# EAGLE design pycopter_board_v1 (EAGLE 7.7.0)
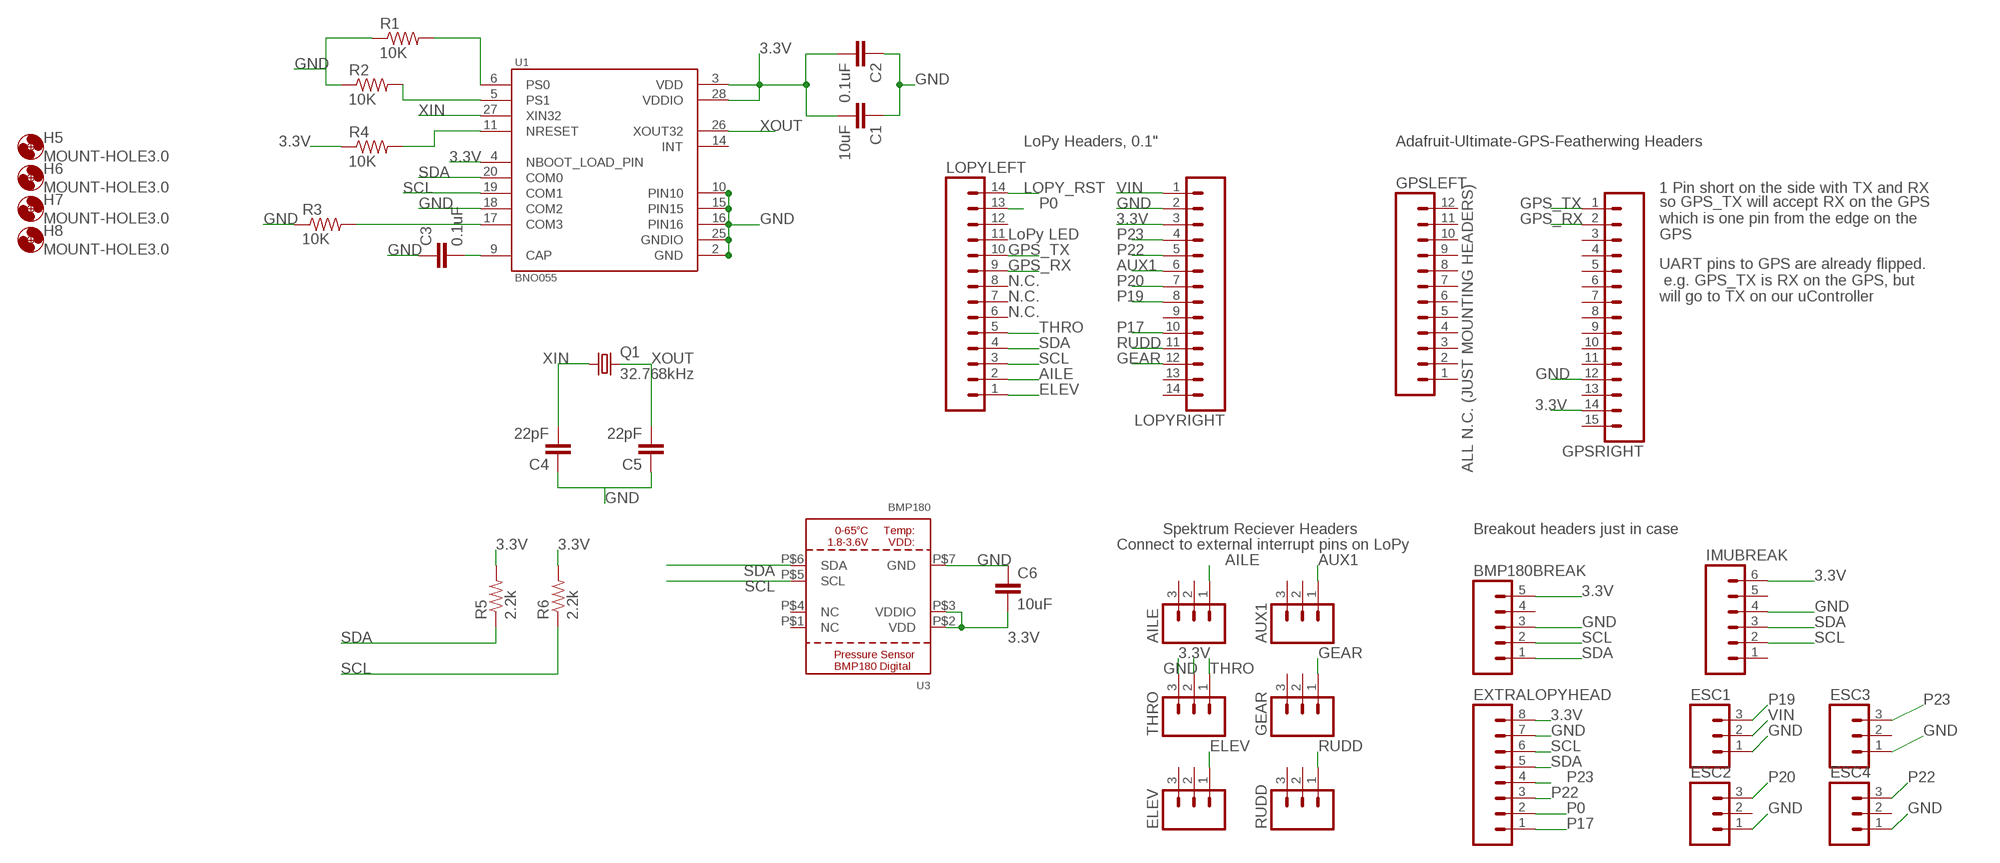
[diagram p0: schematic, sheet 1]

## Parts
AILE  M03PTH  [1X03]
AUX1  M03PTH  [1X03]
BMP180BREAK  M05PTH  [1X05]
C1  10uF  CAP0402-CAP  [0402-CAP]
C2  0.1uF  CAP0402-CAP  [0402-CAP]
C3  0.1uF  CAP0402-CAP  [0402-CAP]
C4  22pF  CAP0402-CAP  [0402-CAP]
C5  22pF  CAP0402-CAP  [0402-CAP]
C6  10uF  CAP0402-CAP  [0402-CAP]
ELEV  M03PTH  [1X03]
ESC1  M03PTH  [1X03]
ESC2  M03PTH  [1X03]
ESC3  M03PTH  [1X03]
ESC4  M03PTH  [1X03]
EXTRALOPYHEAD  M08SILK_FEMALE_PTH  [1X08]
GEAR  M03PTH  [1X03]
GPSLEFT  M12PTH  [1X12]
GPSRIGHT  M15  [1X15]
H5  MOUNT-HOLE3.0  [3,0]
H6  MOUNT-HOLE3.0  [3,0]
H7  MOUNT-HOLE3.0  [3,0]
H8  MOUNT-HOLE3.0  [3,0]
IMUBREAK  M06SILK_FEMALE_PTH  [1X06]
LOPYLEFT  M14  [1X14]
LOPYRIGHT  M14  [1X14]
Q1  32.768kHz  CRYSTALTC38H  [TC38H]
R1  10K  RESISTOR0402-RES  [0402-RES]
R2  10K  RESISTOR0402-RES  [0402-RES]
R3  10K  RESISTOR0402-RES  [0402-RES]
R4  10K  RESISTOR0402-RES  [0402-RES]
R5  2.2k  RESISTOR0402-RES  [0402-RES]
R6  2.2k  RESISTOR0402-RES  [0402-RES]
RUDD  M03PTH  [1X03]
THRO  M03PTH  [1X03]
U1  BNO055  [LGA28R50P4X10_380X520X100]
U3  BMP180  BMP180EXT  [BMP180_EXTENDED]

## Nets
3.3V: BMP180BREAK.5 C1.2 C2.2 C6.2 EXTRALOPYHEAD.8 GPSRIGHT.14 IMUBREAK.6 LOPYRIGHT.3 R4.1 R5.2 R6.2 THRO.2 U1.3(VDD) U1.4(NBOOT_LOAD_PIN) U1.28(VDDIO) U3.P$2(VDD) U3.P$3(VDDIO)
AILE: AILE.1 LOPYLEFT.2
AUX1: AUX1.1 LOPYRIGHT.6
ELEV: ELEV.1 LOPYLEFT.1
GEAR: GEAR.1 LOPYRIGHT.12
GND: BMP180BREAK.3 C1.1 C2.1 C3.1 C4.1 C5.1 C6.1 ESC1.1 ESC2.1 ESC3.1 ESC4.1 EXTRALOPYHEAD.7 GPSRIGHT.12 IMUBREAK.4 LOPYRIGHT.2 R1.1 R2.1 R3.1 THRO.3 U1.2(GND) U1.10(PIN10) U1.15(PIN15) U1.16(PIN16) U1.18(COM2) U1.25(GNDIO) U3.P$7(GND)
GPS_RX: GPSRIGHT.2 LOPYLEFT.9
GPS_TX: GPSRIGHT.1 LOPYLEFT.10
LOPY_RST: LOPYLEFT.14
N$1: C3.2 U1.9(CAP)
N$2: R3.2 U1.17(COM3)
N$3: R1.2 U1.6(PS0)
N$4: R2.2 U1.5(PS1)
N$5: R4.2 U1.11(NRESET)
P0: EXTRALOPYHEAD.2 LOPYLEFT.13
P17: EXTRALOPYHEAD.1 LOPYRIGHT.10
P19: ESC1.3 LOPYRIGHT.8
P20: ESC2.3 LOPYRIGHT.7
P22: ESC4.3 EXTRALOPYHEAD.3 LOPYRIGHT.5
P23: ESC3.3 EXTRALOPYHEAD.4 LOPYRIGHT.4
RUDD: LOPYRIGHT.11 RUDD.1
SCL: BMP180BREAK.2 EXTRALOPYHEAD.6 IMUBREAK.2 LOPYLEFT.3 R6.1 U1.19(COM1) U3.P$5(SCL)
SDA: BMP180BREAK.1 EXTRALOPYHEAD.5 IMUBREAK.3 LOPYLEFT.4 R5.1 U1.20(COM0) U3.P$6(SDA)
THRO: LOPYLEFT.5 THRO.1
VIN: ESC1.2 LOPYRIGHT.1
XIN: C4.2 Q1.1 U1.27(XIN32)
XOUT: C5.2 Q1.2 U1.26(XOUT32)
Unconnected: AILE.2 AILE.3 AUX1.2 AUX1.3 BMP180BREAK.4 ELEV.2 ELEV.3 ESC2.2 ESC3.2 ESC4.2 GEAR.2 GEAR.3 GPSLEFT.1 GPSLEFT.2 GPSLEFT.3 GPSLEFT.4 GPSLEFT.5 GPSLEFT.6 GPSLEFT.7 GPSLEFT.8 GPSLEFT.9 GPSLEFT.10 GPSLEFT.11 GPSLEFT.12 GPSRIGHT.3 GPSRIGHT.4 GPSRIGHT.5 GPSRIGHT.6 GPSRIGHT.7 GPSRIGHT.8 GPSRIGHT.9 GPSRIGHT.10 GPSRIGHT.11 GPSRIGHT.13 GPSRIGHT.15 IMUBREAK.1 IMUBREAK.5 LOPYLEFT.6 LOPYLEFT.7 LOPYLEFT.8 LOPYLEFT.11 LOPYLEFT.12 LOPYRIGHT.9 LOPYRIGHT.13 LOPYRIGHT.14 RUDD.2 RUDD.3 U1.14(INT) U3.P$1(NC) U3.P$4(NC)

## Notes on the sheet
- LoPy Headers, 0.1" | Adafruit-Ultimate-GPS-Featherwing Headers
- 1 Pin short on the side with TX and RX
- LoPy LED
- so GPS_TX will accept RX on the GPS
  which is one pin from the edge on the 
  GPS
- N.C.
- N.C.
- UART pins to GPS are already flipped.
   e.g. GPS_TX is RX on the GPS, but
  will go to TX on our uController
- N.C.
- ALL N.C. (JUST MOUNTING HEADERS)
- Spektrum Reciever Headers | Breakout headers just in case
- Connect to external interrupt pins on LoPy

## Library data of the parts
AILE AUX1 ELEV ESC1-ESC4 GEAR RUDD THRO = SparkFun-Connectors:M03: Header 3 Standard 3-pin 0.1" header. Use with straight break away headers (SKU : PRT-00116), right angle break away headers (PRT-00553), swiss pins (PRT-00743), machine pins (PRT-00117), and female headers (PRT-00115). Molex polarized connector foot print use with SKU : PRT-08232 with associated crimp pins and housings.
BMP180BREAK = SparkFun-Connectors:M05: Header 5 Standard 5-pin 0.1" header. Use with straight break away headers (SKU : PRT-00116), right angle break away headers (PRT-00553), swiss pins (PRT-00743), machine pins (PRT-00117), and female headers (PRT-00115). Molex polarized connector foot print use with SKU : PRT-08230 with associated crimp pins and housings.
C1-C6 = SparkFun-Passives:CAP: Capacitor Standard 0603 ceramic capacitor, and 0.1" leaded capacitor.
EXTRALOPYHEAD = SparkFun-Connectors:M08: Header 8 Standard 8-pin 0.1" header. Use with straight break away headers (SKU : PRT-00116), right angle break away headers (PRT-00553), swiss pins (PRT-00743), machine pins (PRT-00117), and female headers (PRT-00115).; PROD_ID: CONN-08438
GPSLEFT = SparkFun-Connectors:M12: Header 12 Standard 12-pin 0.1" header. Use with straight break away headers (SKU : PRT-00116), right angle break away headers (PRT-00553), swiss pins (PRT-00743), machine pins (PRT-00117), and female headers (PRT-00115).
GPSRIGHT = SparkFun-Connectors:M15: Header 15 Standard 15-pin 0.1" header. Use with straight break away headers (SKU : PRT-00116), right angle break away headers (PRT-00553), swiss pins (PRT-00743), machine pins (PRT-00117), and female headers (PRT-00115).
H5-H8 = holes:MOUNT-HOLE: MOUNTING HOLE with drill center marker
IMUBREAK = SparkFun-Connectors:M06: Header 6 Standard 6-pin 0.1" header. Use with straight break away headers (SKU : PRT-00116), right angle break away headers (PRT-00553), swiss pins (PRT-00743), machine pins (PRT-00117), and female headers (PRT-00115). Molex polarized connector foot print use with SKU : PRT-08094 with associated crimp pins and housings. NOTES ON THE VARIANTS LOCK and LOCK_LONGPADS... This footprint was designed to help hold the alignment of a through-hole component (i.e. 6-pin header) while soldering it into place. You may notice that each hole has been shifted either up or down by 0.005 of an inch from it's more standard position (which is a perfectly straight line). This slight alteration caused the pins (the squares in the middle) to touch the edges of the holes. Because they are alternating, it causes a "brace" to hold the component in place. 0.005 has proven to be the perfect amount of "off-center" position when using our standard breakaway headers. Although looks a little odd when you look at the bare footprint, once you have a header in there, the alteration is very hard to notice. Also,if you push a header all the way into place, it is covered up entirely on the bottom side. This idea of altering the position of holes to aid alignment will be further integrated into the Sparkfun Library for other footprints. It can help hold any component with 3 or more connection pins.; PROD_ID: CONN-08437
LOPYLEFT LOPYRIGHT = SparkFun-Connectors:M14: Header 14 Standard 14-pin 0.1" header. Use with straight break away headers (SKU : PRT-00116), right angle break away headers (PRT-00553), swiss pins (PRT-00743), machine pins (PRT-00117), and female headers (PRT-00115).
Q1 = crystal:CRYSTAL: CRYSTAL; OC_FARNELL: unknown; OC_NEWARK: unknown
R1-R6 = SparkFun-Passives:RESISTOR: Resistor Basic schematic elements and footprints for 0603, 1206, and PTH resistors.
U1 = BNO055:BNO055: BNO055 9-axis Absolute Orientation Sensor ( SiP ) w/Sensors and Sensor Fusion; AVAILABILITY: Good; DESCRIPTION: BNO055 9-axis Absolute Orientation Sensor ( SiP ) w/Sensors and Sensor Fusion; MF: Bosch; MP: BNO055; PACKAGE: LGA-28 Bosch; PRICE: 9.48 USD
U3 = microbuilder:BMP180: BMP180 Digital Pressure Sensor 1.8-3.6V Supply, I2C Interface

## Board
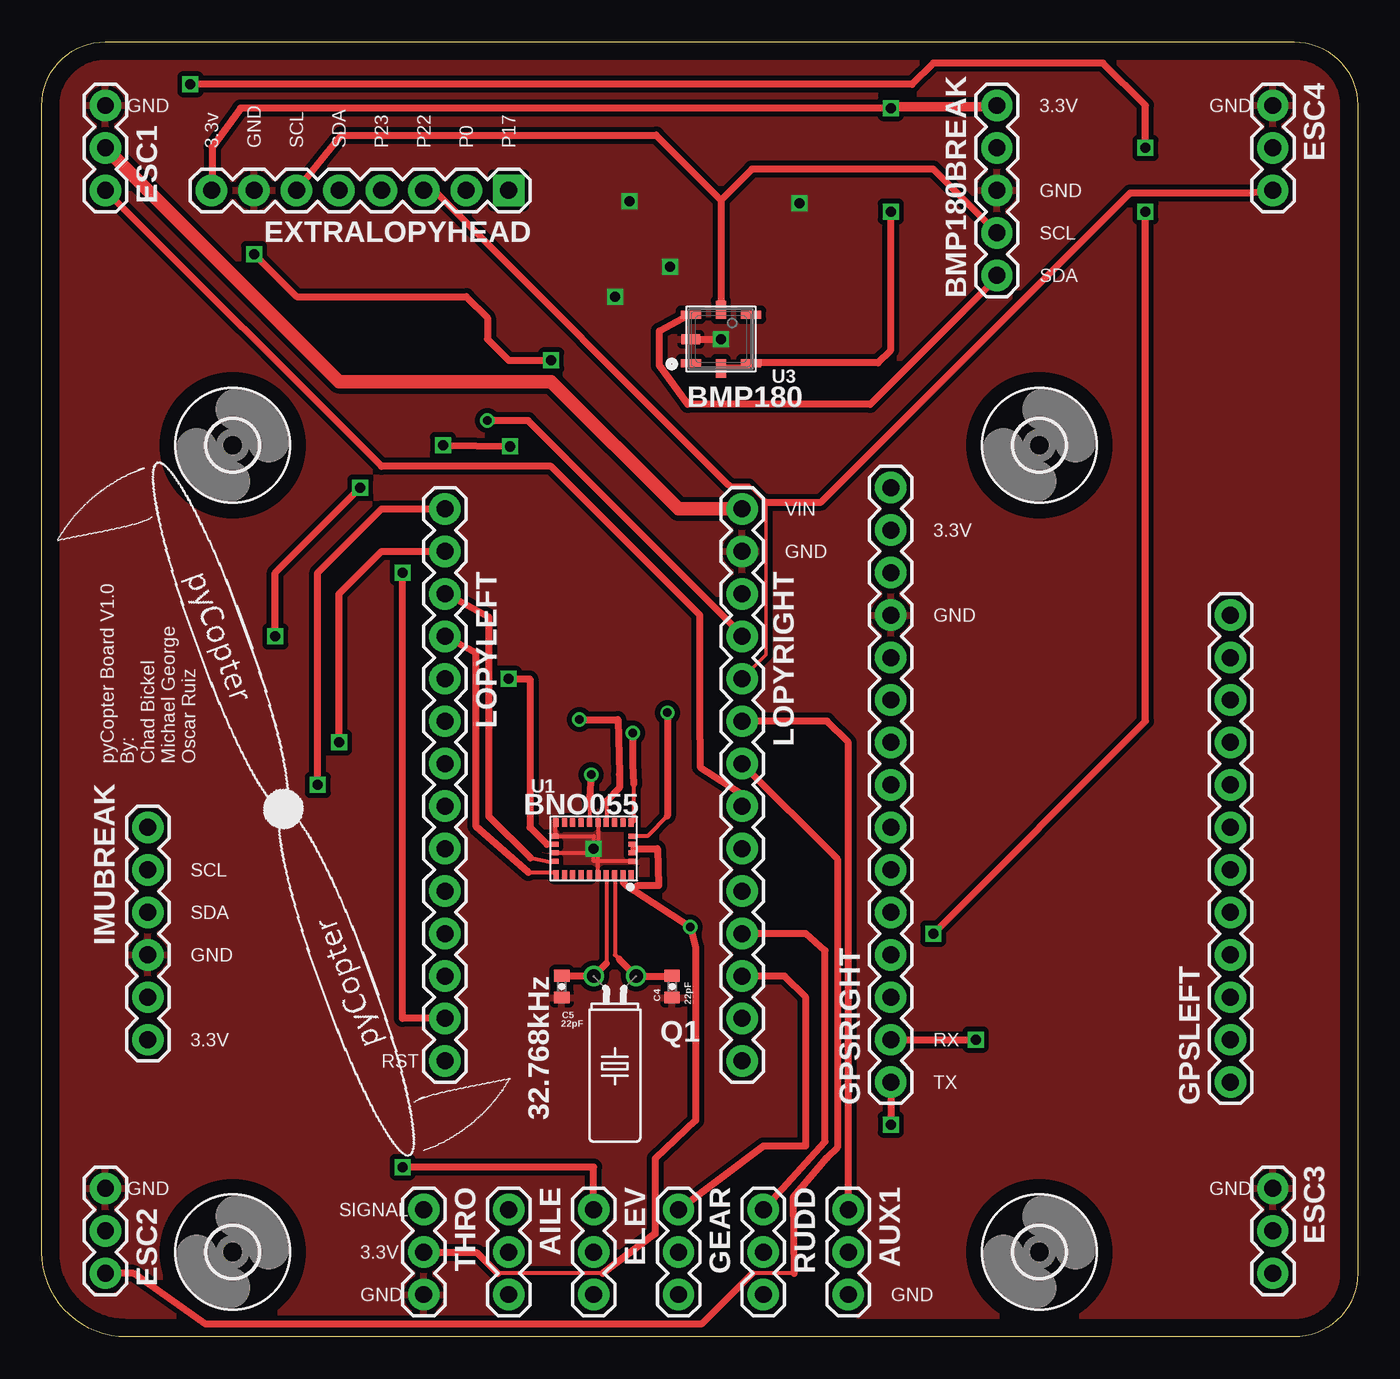
[diagram p1: board, top side]
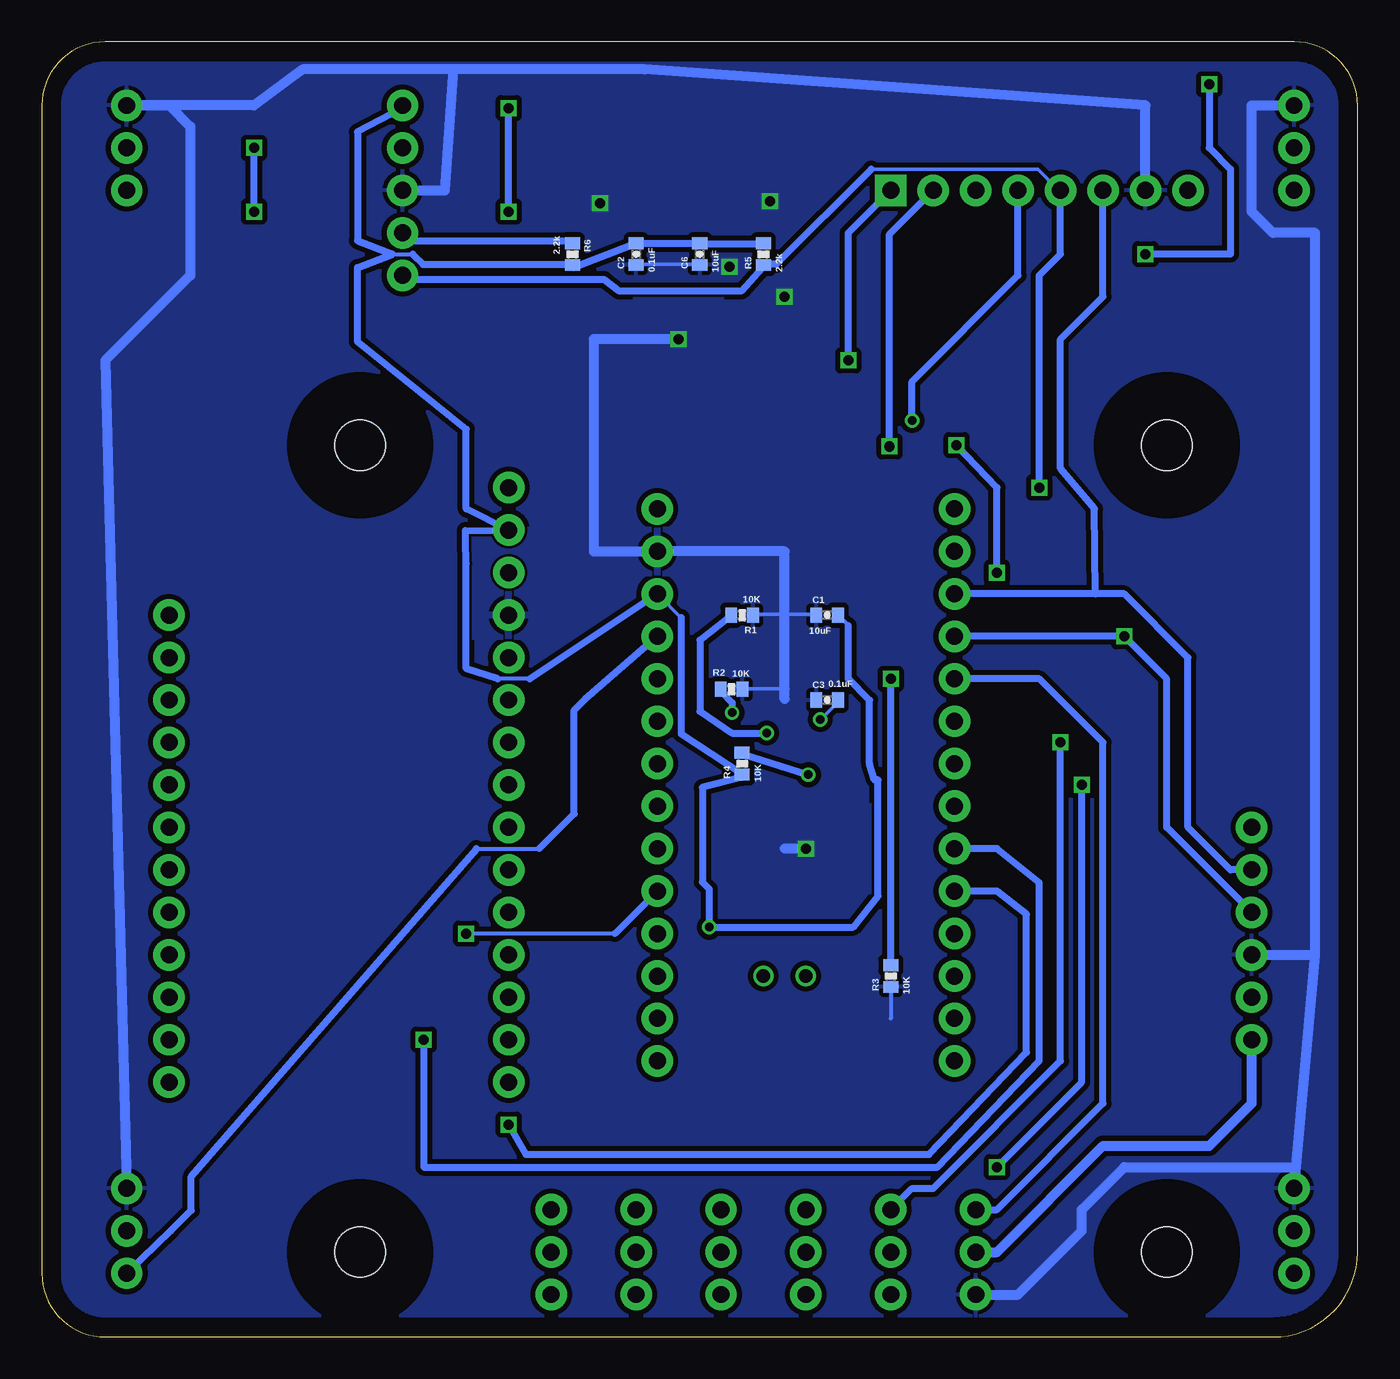
[diagram p2: board, bottom side, seen from below]

Size 78.74 x 77.47 mm. Coordinates in mm from the lower left corner, seen from the top.
Outline: 0,5.08 0,73.66 arc-90 3.81,77.47 74.93,77.47 arc-90 78.74,73.66 78.74,3.81 arc-90 74.93,0 5.08,0 arc-90 0,5.08
Copper layers (1*16): Top 0.0356mm / dielectric 1.5011mm / Bottom 0.0356mm
Design rules "oshpark-2layer": minimum track width 6mil, minimum drill 13mil, track to track 6mil, track to pad 6mil, pad to pad 6mil, via to via 6mil, smd to smd 6mil, copper to edge 15mil, drill to drill 6mil, minimum pad ring 7mil, minimum via ring 7mil, stop-mask expansion 2.5mil, vias tented up to drill 0mil, thermal gap 10mil

### Footprints (pad centres in the part's own frame; a part is rotated, then mirrored left to right if it is on the bottom)
1X03 = drill 1.016 pad 1.88: 1 0,0; 2 2.54,0; 3 5.08,0
1X05 = drill 1.016 pad 1.88: 1 0,0; 2 2.54,0; 3 5.08,0; 4 7.62,0; 5 10.16,0
0402-CAP = smd 0.7 x 0.9: 1 -0.65,0; 2 0.65,0
1X08 = drill 1.016 pad 1.88 square: 1 0,0 | drill 1.016 pad 1.88: 2 2.54,0; 3 5.08,0; 4 7.62,0; 5 10.16,0; 6 12.7,0; 7 15.24,0; 8 17.78,0
1X12 = drill 1.016 pad 1.88: 1 0,0; 2 2.54,0; 3 5.08,0; 4 7.62,0; 5 10.16,0; 6 12.7,0; 7 15.24,0; 8 17.78,0; 9 20.32,0; 10 22.86,0; 11 25.4,0; 12 27.94,0
1X15 = drill 1.016 pad 1.88: 1 0,0; 2 2.54,0; 3 5.08,0; 4 7.62,0; 5 10.16,0; 6 12.7,0; 7 15.24,0; 8 17.78,0; 9 20.32,0; 10 22.86,0; 11 25.4,0; 12 27.94,0; 13 30.48,0; 14 33.02,0; 15 35.56,0
3,0 = hole 3: 0,0
1X06 = drill 1.016 pad 1.88: 1 0,0; 2 2.54,0; 3 5.08,0; 4 7.62,0; 5 10.16,0; 6 12.7,0
1X14 = drill 1.016 pad 1.88: 1 0,0; 2 2.54,0; 3 5.08,0; 4 7.62,0; 5 10.16,0; 6 12.7,0; 7 15.24,0; 8 17.78,0; 9 20.32,0; 10 22.86,0; 11 25.4,0; 12 27.94,0; 13 30.48,0; 14 33.02,0
TC38H = drill 0.813: 1 -1.27,0; 2 1.27,0
0402-RES = smd 0.7 x 0.9: 1 -0.65,0; 2 0.65,0
LGA28R50P4X10_380X520X100 = smd 0.3 x 0.525: 1 -2.25,1.562; 6 -2.25,-1.562; 7 -1.75,-1.562; 8 -1.25,-1.562; 9 -0.75,-1.562; 10 -0.25,-1.562; 11 0.25,-1.562; 12 0.75,-1.562; 13 1.25,-1.562; 14 1.75,-1.562; 15 2.25,-1.562; 20 2.25,1.562; 21 1.75,1.562; 22 1.25,1.562; 23 0.75,1.562; 24 0.25,1.562; 25 -0.25,1.562; 26 -0.75,1.562; 27 -1.25,1.562; 28 -1.75,1.562 | smd 0.425 x 0.3: 2 -2.312,0.75; 3 -2.312,0.25; 4 -2.312,-0.25; 5 -2.312,-0.75; 16 2.312,-0.75; 17 2.312,-0.25; 18 2.312,0.25; 19 2.312,0.75
BMP180_EXTENDED = smd 1.2 x 0.5: P$1 -1.8,-1.45; P$3 1.8,-1.45; P$4 1.8,1.45; P$6 -1.8,1.45 | smd 0.6 x 1.1: P$2 0,-1.75; P$5 0,1.75 | smd 1.1 x 0.6: P$7 -1.8,0

### Placement (x,y rotation side)
AILE  27.94,7.62 270 top
AUX1  48.26,7.62 270 top
BMP180BREAK  57.15,63.5 90 top
C1  31.75,43.18 0 bottom
C2  43.18,64.77 90 bottom
C3  31.75,38.1 0 bottom
C4  37.72,20.95 90 top
C5  31.11,20.95 90 top
C6  39.37,64.77 90 bottom
ELEV  33.02,7.62 270 top
ESC1  3.81,73.66 270 top
ESC2  3.81,8.89 270 top
ESC3  73.66,8.89 270 top
ESC4  73.66,73.66 270 top
EXTRALOPYHEAD  27.94,68.58 180 top
GEAR  38.1,7.62 270 top
GPSLEFT  71.12,15.24 90 top
GPSRIGHT  50.8,15.24 90 top
H5  11.43,5.08 0 top
H6  59.69,5.08 0 top
H7  11.43,53.34 0 top
H8  59.69,53.34 0 top
IMUBREAK  6.35,30.48 270 top
LOPYLEFT  24.13,49.53 270 top
LOPYRIGHT  41.91,49.53 270 top
Q1  34.29,21.59 180 top
R1  36.83,43.18 180 bottom
R2  37.47,38.73 180 bottom
R3  27.94,21.59 90 bottom
R4  36.83,34.29 90 bottom
R5  35.56,64.77 90 bottom
R6  46.99,64.77 270 bottom
RUDD  43.18,7.62 270 top
THRO  22.86,7.62 270 top
U1  33.02,29.21 180 top
U3  40.64,59.69 0 top

### Tracks (layer width: path | path; a pad name or v marks a point on that pad's centre or on a via)
3.3V  (via drill 0.51, 0.6)
  Top 0.203: U3.P$2 40.69,58.06 42.32,58.06 U3.P$3 42.52,58.27 | 57.15,73.51 BMP180BREAK.5 | U1.3 35.41,29.01 35.41,29.21 35.41,29.41 U1.4 | 35.61,26.98 35,26.98 | 34.8,27.58 U1.28 | 23.01,5.03 THRO.2
  Top 0.254: 34.8,27.18 34.8,27.58 | 33.58,3.81 27.28,3.81
  Top 0.406: 42.52,58.27 50.04,58.27 50.8,59.03 v50.8,67.31 | 57.15,73.51 v50.8,73.51 | v50.8,73.51 11.89,73.51 10.19,71.17 10.19,68.61 EXTRALOPYHEAD.8 | 34.8,27.18 35,26.98 v38.81,24.51 39.12,23.32 39.12,12.95 36.7,10.67 36.7,6.17 33.58,3.81 | 35.61,26.98 36.91,27 36.83,29.21 35.41,29.21 | 23.01,5.03 26.06,5.03 27.28,3.81 | v50.8,73.51 50.95,73.66 BMP180BREAK.5
  Bottom 0.203: 35.61,65.38 R5.2 | 39.27,65.38 C6.2 39.47,65.38 | 46.99,63.96 R6.2 46.99,64.16 | 43.13,65.38 C2.2 | 57.15,73.51 BMP180BREAK.5 | LOPYRIGHT.3 40.49,43.03 | 36.83,33.68 R4.1 36.83,33.48 | 30.94,43.03 C1.2
  Bottom 0.254: 57.76,64.77 56.54,64.77 | 49.53,39.37 51.46,39.37 | 30.48,42.56 C1.2
  Bottom 0.406: 39.27,65.38 35.61,65.38 | 39.47,65.38 43.13,65.38 | 46.99,64.16 55.93,64.16 56.54,64.77 | 57.15,73.51 59.84,72.08 59.84,65.58 57.76,64.77 59.84,63.96 59.84,59.54 53.34,54.3 53.34,49.53 GPSRIGHT.14 53.39,48.23 53.39,47.62 53.34,46.28 53.34,39.98 51.46,39.37 | 36.83,33.68 40.49,36.07 40.49,43.03 | 36.83,33.48 39.22,32.87 39.22,27.2 38.81,26.8 v38.81,24.51 30.18,24.51 28.7,26.36 28.7,33.33 28.91,33.33 29.21,34.29 29.21,38.1 30.48,39.37 30.48,42.56 | LOPYRIGHT.3 49.53,39.37 | 46.99,63.96 C2.2 | v50.8,67.31 v50.8,73.51
  Bottom 0.61: THRO.2 21.59,5.08 15.24,11.43 8.89,11.43 6.35,13.97 IMUBREAK.6
AILE  (via drill 0.6)
  Top 0.406: v17.78,35.56 17.78,44.45 20.32,46.99 LOPYLEFT.2
  Bottom 0.406: AILE.1 26.67,8.89 25.4,8.89 17.78,16.51 v17.78,35.56
AUX1
  Top 0.406: AUX1.1 48.26,35.56 46.99,36.83 LOPYRIGHT.6
ELEV  (via drill 0.6)
  Top 0.406: ELEV.1 33.02,10.16 v21.59,10.16 | v16.51,33.02 16.51,45.72 20.32,49.53 LOPYLEFT.1
  Bottom 0.406: v21.59,10.16 16.51,15.24 v16.51,33.02
GEAR
  Top 0.406: GEAR.1 43.18,11.43 45.72,11.43 45.72,20.32 44.45,21.59 LOPYRIGHT.12
GND  (via drill 0.6)
  Top 0.203: 57.15,68.43 BMP180BREAK.3 | 30.73,30.84 U1.15
  Top 0.254: U1.15 30.71,30.77 U1.16 33.02,29.96 v33.02,29.21 | U1.2 33.02,28.46 v33.02,29.21 | U1.10 33.27,29.46 v33.02,29.21 | U1.25 33.27,29.21 v33.02,29.21 | U1.18 33.02,28.96 v33.02,29.21
  Top 0.406: U3.P$7 v40.64,59.69
  Bottom 0.203: 32.56,38.15 C3.1 | 34.29,38.76 36.63,38.76 R2.1 | C1.1 32.56,43.23 34.29,43.23 36.02,43.23 R1.1 | C6.1 39.47,64.16 43.13,64.16 C2.1 43.33,64.16
  Bottom 0.254: R3.1 27.94,19.05
  Bottom 0.406: v40.64,59.69 41.91,59.69
  Bottom 0.61: v33.02,29.21 34.29,29.21 | 34.29,38.15 34.29,38.76 34.29,43.23 34.29,46.99 LOPYRIGHT.2 45.72,46.99 45.72,59.69 v40.64,59.69 | 2.54,22.86 ESC2.1 3.81,10.16 13.97,10.16 16.51,7.62 16.51,6.35 20.32,2.54 THRO.3 | 2.54,22.86 2.54,66.04 5.08,66.04 6.35,67.31 6.35,73.66 ESC1.1 | 54.1,75.82 42.67,75.82 12.7,73.66 EXTRALOPYHEAD.7 | 54.1,75.82 63.12,75.82 66.04,73.66 ESC4.1 71.12,73.66 69.85,72.39 69.85,63.5 74.93,58.42 ESC3.1 | BMP180BREAK.3 54.61,68.58 54.1,75.82 | IMUBREAK.4 2.54,22.86
  other vias: 37.59,64.01 34.29,62.23 35.18,67.94 45.34,67.82
  pour Bottom: 39.37,48.26 53.34,48.26 53.34,41.91 48.26,41.91 48.26,45.72 39.37,45.72
  pour Bottom: 36.83,26.67 36.83,31.75 29.21,31.75 29.21,26.67
  pour Bottom: 43.18,62.23 43.18,57.15 38.1,57.15 38.1,62.23
  pour Bottom (isolate 0.305, rank 6): 5.08,1.27 74.93,1.27 arc90 77.47,3.81 77.47,73.66 arc90 74.93,76.2 3.81,76.2 arc90 1.27,73.66 1.27,5.08 arc90
  pour Top (isolate 0.305, rank 5): 73.66,76.2 74.93,76.2 arc-90 77.47,73.66 77.47,3.81 arc-90 74.93,1.27 5.08,1.27 arc-90 1.27,5.08 1.27,73.66 arc-90 3.81,76.2
GPS_RX  (via drill 0.6)
  Top 0.406: GPSRIGHT.2 v55.88,17.78
  Bottom 0.406: v55.88,17.78 55.88,10.16 25.15,10.16 19.05,16.51 19.05,27.18 21.59,29.21 LOPYLEFT.9
GPS_TX  (via drill 0.6)
  Top 0.406: GPSRIGHT.1 v50.8,12.7
  Bottom 0.406: v50.8,12.7 49.78,10.92 25.65,10.92 19.81,17.02 19.81,25.27 21.59,26.67 LOPYLEFT.10
N$1  (via drill 0.51)
  Top 0.203: 33.78,30.84 U1.9
  Top 0.254: 33.78,32.05 33.78,30.84
  Top 0.406: 33.78,32.05 34.57,32.84 34.57,33.66 34.47,36.93 v32.16,36.93
  Bottom 0.203: v32.16,36.93 31.14,37.95 C3.2
N$2  (via drill 0.6)
  Top 0.254: 30.23,29.46 U1.17
  Top 0.406: v27.94,39.37 29.21,39.37 29.21,30.48 30.23,29.46
  Bottom 0.406: R3.2 v27.94,39.37
N$3  (via drill 0.51)
  Top 0.203: 35.41,30.84 U1.6
  Top 0.254: 35.41,33.07 35.41,30.84
  Top 0.406: 35.41,33.07 35.36,34.29 v35.36,36.12
  Bottom 0.203: 37.64,43.03 R1.2
  Bottom 0.406: v35.36,36.12 37.44,36.12 39.37,37.41 39.37,41.68 37.64,43.03
N$4  (via drill 0.51)
  Top 0.203: 35.41,30.02 U1.5
  Top 0.254: 37.44,31.17 36.23,29.96 U1.5
  Top 0.406: v37.44,37.34 37.44,31.17
  Bottom 0.203: 38.05,38.56 R2.2
  Bottom 0.406: v37.44,37.34 37.44,37.95 38.05,38.56
N$5  (via drill 0.51)
  Top 0.203: 32.77,30.84 U1.11
  Top 0.254: 32.77,32.26 32.77,30.84
  Top 0.406: v32.87,33.63 32.77,32.26
  Bottom 0.203: 36.83,34.9 R4.2
  Bottom 0.406: 36.83,34.9 v32.87,33.63
P0  (via drill 0.6)
  Top 0.254: 24.23,19.05 LOPYLEFT.13
  Top 0.406: LOPYLEFT.13 21.59,19.05 v21.59,45.72 | v24,53.34 v28.02,53.26
  Bottom 0.203: 25.45,68.43 EXTRALOPYHEAD.2
  Bottom 0.406: v21.59,45.72 21.59,50.8 v24,53.34 | v28.02,53.26 28.02,65.96 EXTRALOPYHEAD.2
P17  (via drill 0.6)
  Top 0.406: v53.34,24.13 66.04,36.83 v66.04,67.31 | v66.04,71.12 66.04,73.66 63.5,76.2 53.34,76.2 52.07,74.93 v8.89,74.93 | v12.7,64.77 15.24,62.23 25.4,62.23 26.67,60.96 26.67,59.69 27.94,58.42 v30.48,58.42
  Bottom 0.254: 44.45,24.13 v53.34,24.13
  Bottom 0.406: LOPYRIGHT.10 44.45,24.13 | v66.04,67.31 v66.04,71.12 | v8.89,74.93 8.89,71.12 7.62,69.85 7.62,64.77 v12.7,64.77 | v30.48,58.42 30.48,66.04 EXTRALOPYHEAD.1
P19
  Top 0.203: 41.91,32.46 LOPYRIGHT.8
  Top 0.406: 41.91,32.46 39.4,34.09 39.4,35.71 39.37,38.86 39.37,43.18 30.48,52.07 20.32,52.07 ESC1.3
P20
  Top 0.254: 45.01,3.81 42.52,3.81
  Top 0.406: ESC2.3 5.49,3.81 9.8,0.76 39.47,0.76 42.52,3.81 | 45.01,3.81 44.96,8.33 46.99,10.72 47.6,11.33 47.6,28.6 LOPYRIGHT.7
P22
  Top 0.203: 23.62,68.43 23.01,68.43 EXTRALOPYHEAD.3 | 41.1,50.95 42.32,50.95 43.33,49.94 43.33,40.79 LOPYRIGHT.5
  Top 0.406: 41.1,50.95 23.62,68.43 | 43.33,49.94 46.63,49.94 65.13,68.43 72.29,68.43 ESC4.3
P23  (via drill 0.51)
  Top 0.203: 41.91,42.01 LOPYRIGHT.4
  Top 0.406: v26.67,54.81 29.11,54.81 41.91,42.01
  Bottom 0.203: 20.37,68.43 EXTRALOPYHEAD.4
  Bottom 0.254: 52.73,29.21 48.97,29.21
  Bottom 0.406: LOPYRIGHT.4 46.23,38.15 46.89,37.49 46.89,31.29 48.97,29.21 | 52.73,29.21 69.8,9.6 69.8,7.57 71.02,6.35 ESC3.3 | v26.67,54.81 26.67,57.15 20.32,63.5 EXTRALOPYHEAD.4
RUDD
  Top 0.406: RUDD.1 46.86,11.68 46.86,23.11 45.72,24.13 LOPYRIGHT.11
SCL
  Top 0.203: 40.69,61.52 U3.P$5 40.49,61.52 40.51,61.52 | 30.53,28.4 U1.19 | 24.23,44.45 LOPYLEFT.3
  Top 0.254: 29.23,28.65 30.53,28.4
  Top 0.406: 29.23,28.65 26.75,31.14 26.75,43.08 24.23,44.45 | EXTRALOPYHEAD.6 17.91,71.88 36.75,71.88 40.64,68 | BMP180BREAK.2 53.34,69.85 42.49,69.85 40.64,68 | 40.64,68 U3.P$5
  Bottom 0.203: 46.99,65.58 R6.1 | 57.15,65.99 BMP180BREAK.2 | 15.29,68.43 EXTRALOPYHEAD.6
  Bottom 0.406: IMUBREAK.2 7.62,27.94 10.16,30.48 10.16,40.64 13.97,44.45 15.7,44.45 | 15.7,44.45 LOPYLEFT.3 | 46.99,65.58 56.74,65.58 57.15,65.99 | 15.7,44.45 15.75,49.53 17.78,51.94 17.78,59.69 15.24,62.23 EXTRALOPYHEAD.6
SDA  (via drill 0.6 pad 0.25)
  Top 0.203: 38.66,61.11 U3.P$6 | 57.15,63.35 BMP180BREAK.1 | 30.73,27.79 U1.20
  Top 0.254: 29.11,27.79 30.73,27.79
  Top 0.406: 38.66,61.11 36.96,60.17 36.96,58.12 38.66,55.78 49.58,55.78 57.15,63.35 | 29.11,27.79 25.96,30.56 25.96,40.97 LOPYLEFT.4 | v13.97,41.91 13.97,45.72 v19.05,50.8
  Bottom 0.203: 29.11,69.85 19.15,69.85 17.93,68.63 EXTRALOPYHEAD.5 17.93,68.43 | 35.41,64.16 R5.1 35.61,63.96 | 24.23,42.01 LOPYLEFT.4 | 57.15,63.35 BMP180BREAK.1
  Bottom 0.406: IMUBREAK.3 11.43,30.48 11.43,39.37 v13.97,41.91 LOPYLEFT.4 | 35.41,64.16 34.8,64.16 29.11,69.85 | 35.61,63.96 36.88,62.56 44.2,62.56 45.09,63.25 56.9,63.25 BMP180BREAK.1 | v19.05,50.8 19.05,63.5 17.78,64.77 EXTRALOPYHEAD.5
THRO
  Bottom 0.406: THRO.1 21.59,7.62 15.24,13.97 15.24,35.56 19.05,39.37 LOPYLEFT.5
VIN
  Top 0.813: ESC1.2 17.78,57.15 30.48,57.15 38.1,49.53 LOPYRIGHT.1
XIN
  Top 0.254: U1.27 34.29,27.63 34.29,22.86 34.54,22.61
  Top 0.406: 34.54,22.61 Q1.1 37.7,21.59 C4.2
XOUT
  Top 0.203: 33.78,27.58 U1.26
  Top 0.254: 33.78,27.58 33.78,22.35
  Top 0.406: 33.78,22.35 Q1.2 33.01,21.61 C5.2

### Text on the board
tNames: GND | 3.3V | GND | 3.3v | GND | SCL | SDA | P23 | P22 | P0 | P17 | GND | SCL | SDA | VIN | 3.3V | GND | GND | pyCopter Board V1.0 / By: / Chad Bickel / Michael George / Oscar Ruiz | SCL | SDA | GND | 3.3V | RX | RST | TX | GND | GND | SIGNAL | 3.3V | GND | GND